# Altium schematic sheet 202011AWSNP04.SchDoc
size A4
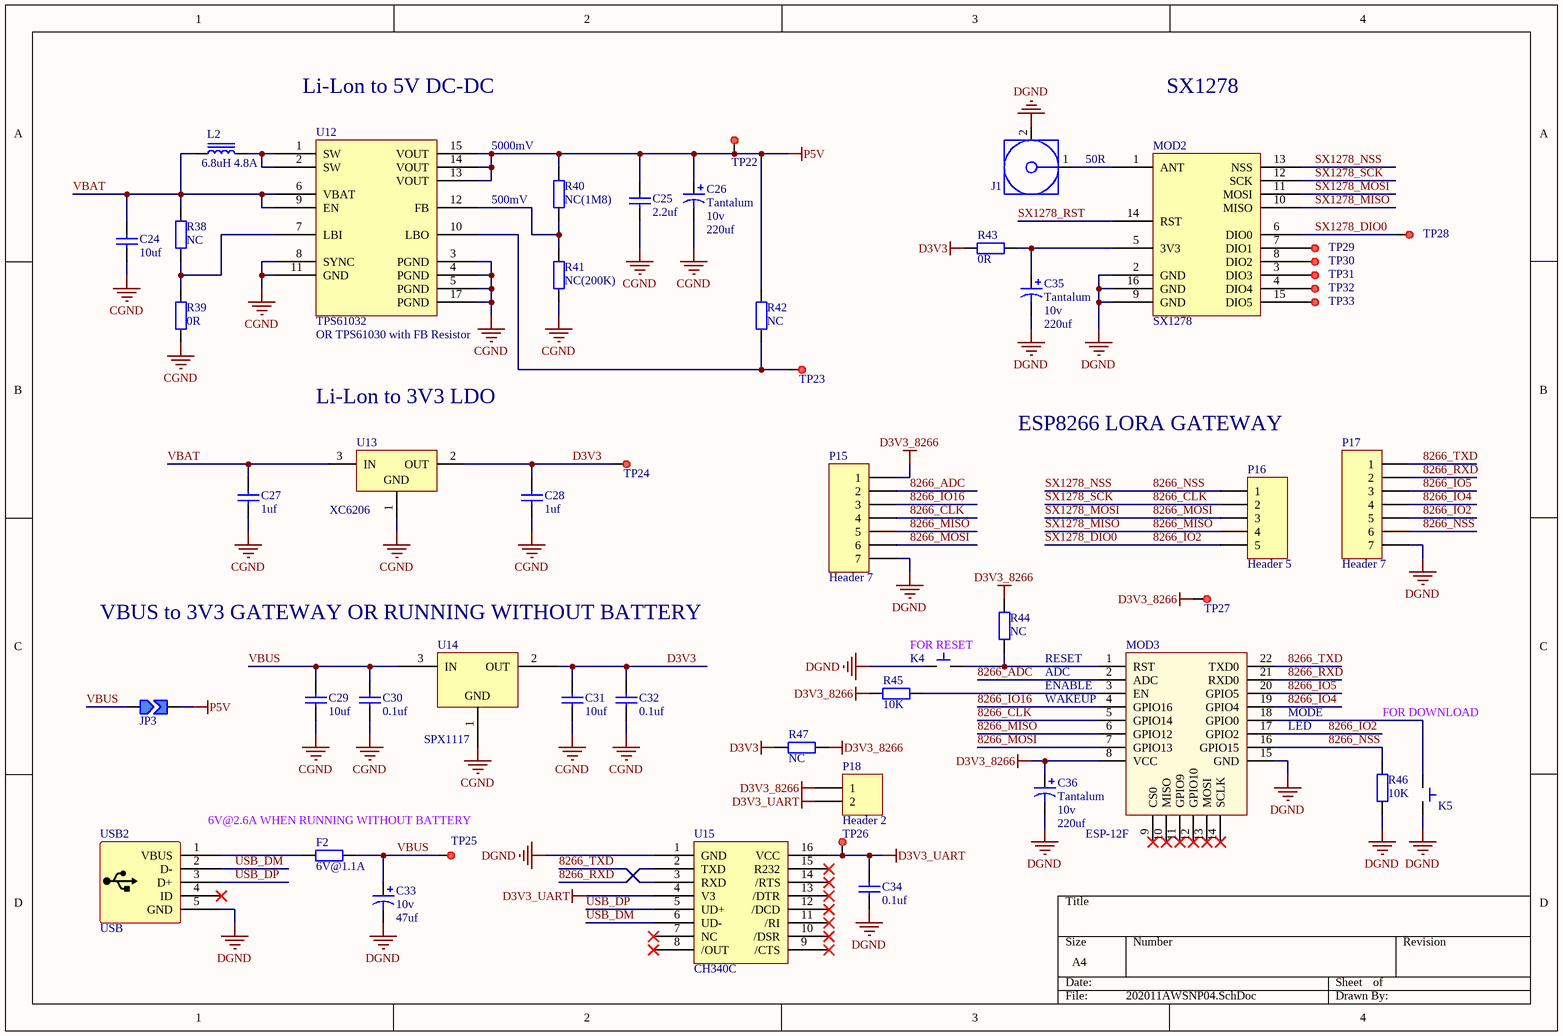
[diagram p0: 202011AWSNP04.SchDoc]

## Parts
C24  value 10uf  [C0805]  (hidden comment: Cap)
C25  value 2.2uf  [C0805]  (hidden comment: Cap)
C26  Tantalum  value 220uf  voltage: 10v  [C2917T-7343D]
C27  value 1uf  [C0805]  (hidden comment: Cap)
C28  value 1uf  [C0805]  (hidden comment: Cap)
C29  value 10uf  [C0805]  (hidden comment: Cap)
C30  value 0.1uf  [C0805]  (hidden comment: Cap)
C31  value 10uf  [C0805]  (hidden comment: Cap)
C32  value 0.1uf  [C0805]  (hidden comment: Cap)
C33  value 47uf  voltage: 10v  [C4X5.4-SMD]  (hidden comment: Cap2)
C34  value 0.1uf  [C0805]  (hidden comment: Cap)
C35  Tantalum  value 220uf  voltage: 10v  [C2917T-7343D]
C36  Tantalum  value 220uf  voltage: 10v  [C2917T-7343D]
F2  value 6V@1.1A  [F1812]  (hidden comment: Fuse)
J1  SMA  [SMA-3]  (value not drawn)
JP3  Jumper  [Jumper-2]  (value not drawn)
K4  Button  [Button-SMT-Small]  (value not drawn)
K5  Button  [Button-SMT-Small]  (value not drawn)
L2  value 6.8uH 4.8A  [L10104]  (hidden comment: Inductor Iron)
MOD2  SX1278  [MODULE SX1278]
MOD3  ESP-12F  [MODULE ESP-12F]
P15  Header 7  [HDR1X7]
P16  Header 5  [HDR1X5]
P17  Header 7  [HDR1X7]
P18  Header 2  [HDR1X2]
R38  value NC  [R0805]  (hidden comment: Res)
R39  value 0R  [R0805]  (hidden comment: Res)
R40  value NC(1M8)  [R0805]  (hidden comment: Res)
R41  value NC(200K)  [R0805]  (hidden comment: Res)
R42  value NC  [R0805]  (hidden comment: Res)
R43  value 0R  [R0805]  (hidden comment: Res)
R44  value NC  [R0805]  (hidden comment: Res)
R45  value 10K  [R0805]  (hidden comment: Res)
R46  value 10K  [R0805]  (hidden comment: Res)
R47  value NC  [R0805]  (hidden comment: Res)
TP22  TestPoint  [TestPoint-R30]  (value not drawn)
TP23  TestPoint  [TestPoint-R30]  (value not drawn)
TP24  TestPoint  [TestPoint-R30]  (value not drawn)
TP25  TestPoint  [TestPoint-R30]  (value not drawn)
TP26  TestPoint  [TestPoint-R30]  (value not drawn)
TP27  TestPoint  [TestPoint-R30]  (value not drawn)
TP28  TestPoint  [TestPoint-R30]  (value not drawn)
TP29  TestPoint  [TestPoint-R30]  (value not drawn)
TP30  TestPoint  [TestPoint-R30]  (value not drawn)
TP31  TestPoint  [TestPoint-R30]  (value not drawn)
TP32  TestPoint  [TestPoint-R30]  (value not drawn)
TP33  TestPoint  [TestPoint-R30]  (value not drawn)
U12  TPS61032  [TPS61030-TSSOP16]
U13  XC6206  [XC6206-SOT23]
U14  SPX1117  [SPX1117-SOT223]
U15  CH340C  [CH340C-SOP16]
USB2  USB  [USB-Mini-SMT]

## Nets
CGND: C24.1 C25.1 C26.2 C27.1 C28.1 C29.1 C30.1 C31.1 C32.1 R39.2 R41.2 U12.3(PGND) U12.4(PGND) U12.5(PGND) U12.8(SYNC) U12.11(GND) U12.17(PGND) U13.1(GND) U14.1(GND)
D3V3: C28.2 C31.2 C32.2 R43.2 R47.1 TP24.1 U13.2(OUT) U14.2(OUT)
D3V3_8266: C36.1 MOD3.8(VCC) P15.1 P18.1 R44.1 R45.1 R47.2 TP27.1
D3V3_UART: C34.1 P18.2 TP26.1 U15.4(V3) U15.16(VCC)
DGND: C33.2 C34.2 C35.2 C36.2 J1.2(GND) K4.1(IN) K5.2(OUT) MOD2.2(GND) MOD2.9(GND) MOD2.16(GND) MOD3.15(GND) P15.7 P17.7 R46.1 U15.1(GND) USB2.5(GND)
P5V: C25.2 C26.1 JP3.2 R40.1 R42.1 TP22.1 U12.13(VOUT) U12.14(VOUT) U12.15(VOUT)
8266_ADC: MOD3.2(ADC) P15.2
8266_CLK: MOD2.12(SCK) MOD3.5(GPIO14) P15.4 P16.2  [also labelled SX1278_SCK]
8266_IO2: MOD2.6(DIO0) MOD3.17(GPIO2) P16.5 P17.5 TP28.1  [also labelled SX1278_DIO0]
8266_IO4: MOD3.19(GPIO4) P17.4
8266_IO5: MOD3.20(GPIO5) P17.3
8266_IO16: MOD3.4(GPIO16) P15.3
8266_MISO: MOD2.10(MISO) MOD3.6(GPIO12) P15.5 P16.4  [also labelled SX1278_MISO]
8266_MOSI: MOD2.11(MOSI) MOD3.7(GPIO13) P15.6 P16.3  [also labelled SX1278_MOSI]
8266_NSS: MOD2.13(NSS) MOD3.16(GPIO15) P16.1 P17.6 R46.2  [also labelled SX1278_NSS]
8266_RXD: MOD3.21(RXD0) P17.2 U15.2(TXD)
8266_TXD: MOD3.22(TXD0) P17.1 U15.3(RXD)
SX1278_RST: MOD2.14(RST)
USB_DM: U15.6(UD-) USB2.2(D-)
USB_DP: U15.5(UD+) USB2.3(D+)
VBAT: C24.2 C27.2 L2.1 R38.1 U12.6(VBAT) U12.9(EN) U13.3(IN)
VBUS: C29.2 C30.2 C33.1 F2.2 JP3.1 TP25.1 U14.3(IN)
NetC35_1: C35.1 MOD2.5(3V3) R43.1
NetF2_1: F2.1 USB2.1(VBUS)
NetJ1_1: J1.1(Signal) MOD2.1(ANT)
NetK4_2: K4.2(OUT) MOD3.1(RST) R44.2
NetK5_1: K5.1(IN) MOD3.18(GPIO0)
NetL2_2: L2.2 U12.1(SW) U12.2(SW)
NetMOD2_3: MOD2.3(DIO3) TP31.1
NetMOD2_4: MOD2.4(DIO4) TP32.1
NetMOD2_7: MOD2.7(DIO1) TP29.1
NetMOD2_8: MOD2.8(DIO2) TP30.1
NetMOD2_15: MOD2.15(DIO5) TP33.1
NetMOD3_3: MOD3.3(EN) R45.2
NetR38_2: R38.2 R39.1 U12.7(LBI)
NetR40_2: R40.2 R41.1 U12.12(FB)
NetR42_2: R42.2 TP23.1 U12.10(LBO)

Not connected (* = marked no-connect by the designer): MOD3 9(CS0)* 10(MISO)* 11(GPIO9)* 12(GPIO10)* 13(MOSI)* 14(SCLK)*; U15 7(NC)* 8(/OUT)* 9(/CTS)* 10(/DSR)* 11(/RI)* 12(/DCD)* 13(/DTR)* 14(/RTS)* 15(R232)*; USB2 4(ID)*

## Notes on the sheet
- Li-Lon to 5V DC-DC
- SX1278
- 5000mV
- (near J1) 50R
- 500mV
- (near U12) OR TPS61030 with FB Resistor
- Li-Lon to 3V3 LDO
- ESP8266 LORA GATEWAY
- (near U14) VBUS to 3V3 GATEWAY OR RUNNING WITHOUT BATTERY
- (near K4) FOR RESET
- WAKEUP
- ENABLE
- RESET
- ADC
- (near MOD3) MODE
- FOR DOWNLOAD
- (near MOD3) LED
- 6V@2.6A WHEN RUNNING WITHOUT BATTERY

## Library data of the parts
C26 C35 C36 = Cap-Tantalum
K4 K5 = Button: 轻触开关
L2 = Inductor Iron: Magnetic-Core Inductor
MOD2 = Module SX1278
MOD3 = Module ESP-12F
P15 P17 = Header 7: Header, 7-Pin; LatestRevisionDate: 17-Jul-2002; LatestRevisionNote: Re-released for DXP Platform.; Publisher: Altium Limited
P16 = Header 5: Header, 5-Pin; LatestRevisionDate: 17-Jul-2002; LatestRevisionNote: Re-released for DXP Platform.; Publisher: Altium Limited
P18 = Header 2: Header, 2-Pin; LatestRevisionDate: 17-Jul-2002; LatestRevisionNote: Re-released for DXP Platform.; Publisher: Altium Limited
R38-R47 = Res: 电阻
TP22-TP33 = TestPoint: 测试点
U12 = TPS61032PWP: TPS6103x 96% Efficient Synchronous Boost Converter With 4A Switch
U13 = XC6206: Low ESR Cap. Compatible Positive Voltage Regulators
U14 = SPX1117: 800mA Low Dropout Voltage Regulator
U15 = CH340C: USB 转串口芯片